# Altium schematic sheet RTC.SchDoc
size A4; SheetNumber: 6; SheetTotal: 7
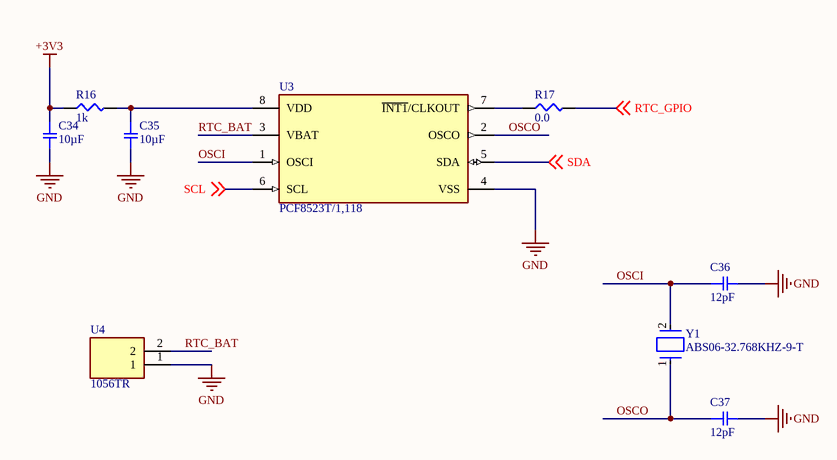
[diagram p0: RTC.SchDoc]

## Parts
C34  10µF  [SMD-0402C]
C35  10µF  [SMD-0402C]
C36  12pF  [SMD-0402C]
C37  12pF  [SMD-0402C]
R16  1k  [SMD-0402-RES]
R17  0.0  [SMD-0402-RES]
U3  PCF8523T/1,118  [FP-SOT96-1-IPC_B]
U4  1056TR  [1056TR]
Y1  ABS06-32.768KHZ-9-T  [FP-ABS06-MFG]

## Nets
+3V3: C34.1 R16.1
GND: C34.2 C35.2 C36.2 C37.2 U3.4(VSS) U4.1
OSCI: C36.1 U3.1(OSCI) Y1.2
OSCO: C37.1 U3.2(OSCO) Y1.1
RTC_BAT: U3.3(VBAT) U4.2
RTC_GPIO: R17.2 ; off-sheet RTC_GPIO
SCL: U3.6(SCL) ; off-sheet SCL
SDA: U3.5(SDA) ; off-sheet SDA
NetC35_1: C35.1 R16.2 U3.8(VDD)
NetR17_1: R17.1 U3.7(~{INT1}/CLKOUT)

## Library data of the parts
C34 C35 = GRJ155R60J106ME11D: CAP CER 10UF 6.3V X5R 0402; Manufacturer: Murata Electronics North America; Factory Stock: 0; Unit Price (USD): 0.23; Minimum Quantity: 1; Tolerance: ±20%; Datasheets: http://psearch.en.murata.com/capacitor/product/GRJ155R60J106ME11%23.pdf; Image: //media.digikey.com/Renders/Murata%20Renders/ZRB-SERIES-0402.jpg; Digi-Key Part Number: 490-13211-1-ND; Part Number: GRJ155R60J106ME11D; Quantity Available: 64064; @ qty: 0; Packaging: Cut Tape (CT); Series: GRJ; Part Status: Active; Value: 10µF; Voltage: 6.3V; Temperature Coefficient: X5R; Operating Temperature: -55°C ~ 85°C; Features: Derating Recommended, Soft Termination; Ratings: -; Applications: Boardflex Sensitive; Mounting Type: Surface Mount, MLCC; Package / Case: 0402 (1005 Metric); Size / Dimension: 0.039" L x 0.020" W (1.00mm x 0.50mm); Height - Seated (Max): -; Thickness (Max): 0.028" (0.70mm); Lead Spacing: -; Lead Style: -
C36 C37 = GCM1555C1H120JA16D: CAP CER 12PF 50V NP0 0402; Manufacturer: Murata Electronics North America; Factory Stock: 0; Unit Price (USD): 0.1; Minimum Quantity: 1; Tolerance: ±5%; Temperature Coefficient: C0G, NP0; Datasheets: http://www.murata.com/~/media/webrenewal/support/library/catalog/products/capacitor/mlcc/c03e.ashx; Image: //media.digikey.com/Renders/Murata%20Renders/ZRB-SERIES-0402.jpg; Digi-Key Part Number: 490-12649-1-ND; Part Number: GCM1555C1H120JA16D; Quantity Available: 29045; @ qty: 0; Packaging: Cut Tape (CT); Series: GCM; Part Status: Active; Value: 12pF; Voltage: 50V; Operating Temperature: -55°C ~ 125°C; Features: -; Ratings: AEC-Q200; Applications: Automotive; Mounting Type: Surface Mount, MLCC; Package / Case: 0402 (1005 Metric); Size / Dimension: 0.039" L x 0.020" W (1.00mm x 0.50mm); Height - Seated (Max): -; Thickness (Max): 0.022" (0.55mm); Lead Spacing: -; Lead Style: -
R16 = ERJ-2GEJ102X: RES SMD 1K OHM 5% 1/10W 0402; Manufacturer: Panasonic Electronic Components; Factory Stock: 0; Unit Price (USD): 0.00350; @ qty: 1500; Minimum Quantity: 1; Power (Watts): 0.1W, 1/10W; Temperature Coefficient: ±200ppm/°C; Part Number: ERJ-2GEJ102X; Datasheets: http://industrial.panasonic.com/www-cgi/jvcr13pz.cgi?E+PZ+3+AOA0001+ERJ2GEJ102X+7+WW; Image: //media.digikey.com/Photos/Panasonic%20Photos/ERJ-PA2-Series.jpg; Digi-Key Part Number: P1.0KJCT-ND; Quantity Available: 1939857; Packaging: Cut Tape (CT); Series: ERJ; Part Status: Active; Value: 1k; Tolerance: ±5%; Composition: Thick Film; Features: Automotive AEC-Q200; Operating Temperature: -55°C ~ 155°C; Package / Case: 0402 (1005 Metric); Supplier Device Package: 0402; Size / Dimension: 0.039" L x 0.020" W (1.00mm x 0.50mm); Height - Seated (Max): 0.016" (0.40mm); Number of Terminations: 2; Failure Rate: -
R17 = ERJ-2GE0R00X: RES SMD 0.0OHM JUMPER 1/10W 0402; Manufacturer: Panasonic Electronic Components; Factory Stock: 0; Unit Price (USD): 0.00384; @ qty: 1500; Minimum Quantity: 1; Power (Watts): 0.1W, 1/10W; Part Number: ERJ-2GE0R00X; Datasheets: http://industrial.panasonic.com/www-cgi/jvcr13pz.cgi?E+PZ+3+AOA0001+ERJ2GE0R00X+7+WW; Image: //media.digikey.com/Photos/Panasonic%20Photos/ERJ-PA2-Series.jpg; Digi-Key Part Number: P0.0JCT-ND; Quantity Available: 3152483; Packaging: Cut Tape (CT); Series: ERJ; Part Status: Active; Value: 0.0; Tolerance: Jumper; Composition: Thick Film; Features: Automotive AEC-Q200; Temperature Coefficient: -; Operating Temperature: -55°C ~ 155°C; Package / Case: 0402 (1005 Metric); Supplier Device Package: 0402; Size / Dimension: 0.039" L x 0.020" W (1.00mm x 0.50mm); Height - Seated (Max): 0.016" (0.40mm); Number of Terminations: 2; Failure Rate: -
U3 = CMP-10083-000014-1: IC RTC CLK/CALENDAR I2C 8-SOIC; Time Format: HH:MM:SS; Min Supply Voltage: 1.2V; Max Supply Voltage: 5.5V; Logic Function: Clock; Min Operating Temperature: -40°C; Case/Package: SO; Radiation Hardening: No; Interface: I2C; Max Operating Temperature: 85°C; Contact Plating: Gold; Packaging: Tape and Reel; Package Quantity: 2500; Lead Free: Lead Free; Number of Pins: 8; Mount: Surface Mount; REACH SVHC: No SVHC
U4 = 1056TR: Undefined or Miscellaneous; Manufacturer_Name: Keystone Electronics; Datasheet Link: http://www.keyelco.com/product-pdf.cfm?p=4028; Manufacturer_Part_Number: 1056TR; Mouser Part Number: 534-1056TR; Mouser Price/Stock: https://www.mouser.co.uk/ProductDetail/Keystone-Electronics/1056TR?qs=sZfk%252BfAlGe6t6AyLJNcPdQ%3D%3D
Y1 = CMP-27762-015421-1: Crystal 32.768kHz ±20ppm (Tol) 9pF FUND 90kΩ 2-Pin Mini-CSMD T/R; ESR (Equivalent Series Resistance): 90kR; Max Operating Temperature: 85°C; Frequency Tolerance: 20ppm; Case/Package: CSMD; Termination: SMD/SMT; RoHS Compliant: Yes; Height: 0.6mm; Load Capacitance: 9pF; Packaging: Tape and Reel; Depth: 1.2mm; Tolerance: 20ppm; Frequency: 32.768kHz; Series: ABS06; Width: 1.2mm; Length: 2mm; Number of Pins: 2; Min Operating Temperature: -40°C; Mount: Surface Mount; Lead Free: Lead Free; Package Quantity: 3000